# EAGLE design medidor_nao_invasivo (EAGLE 9.5.0)
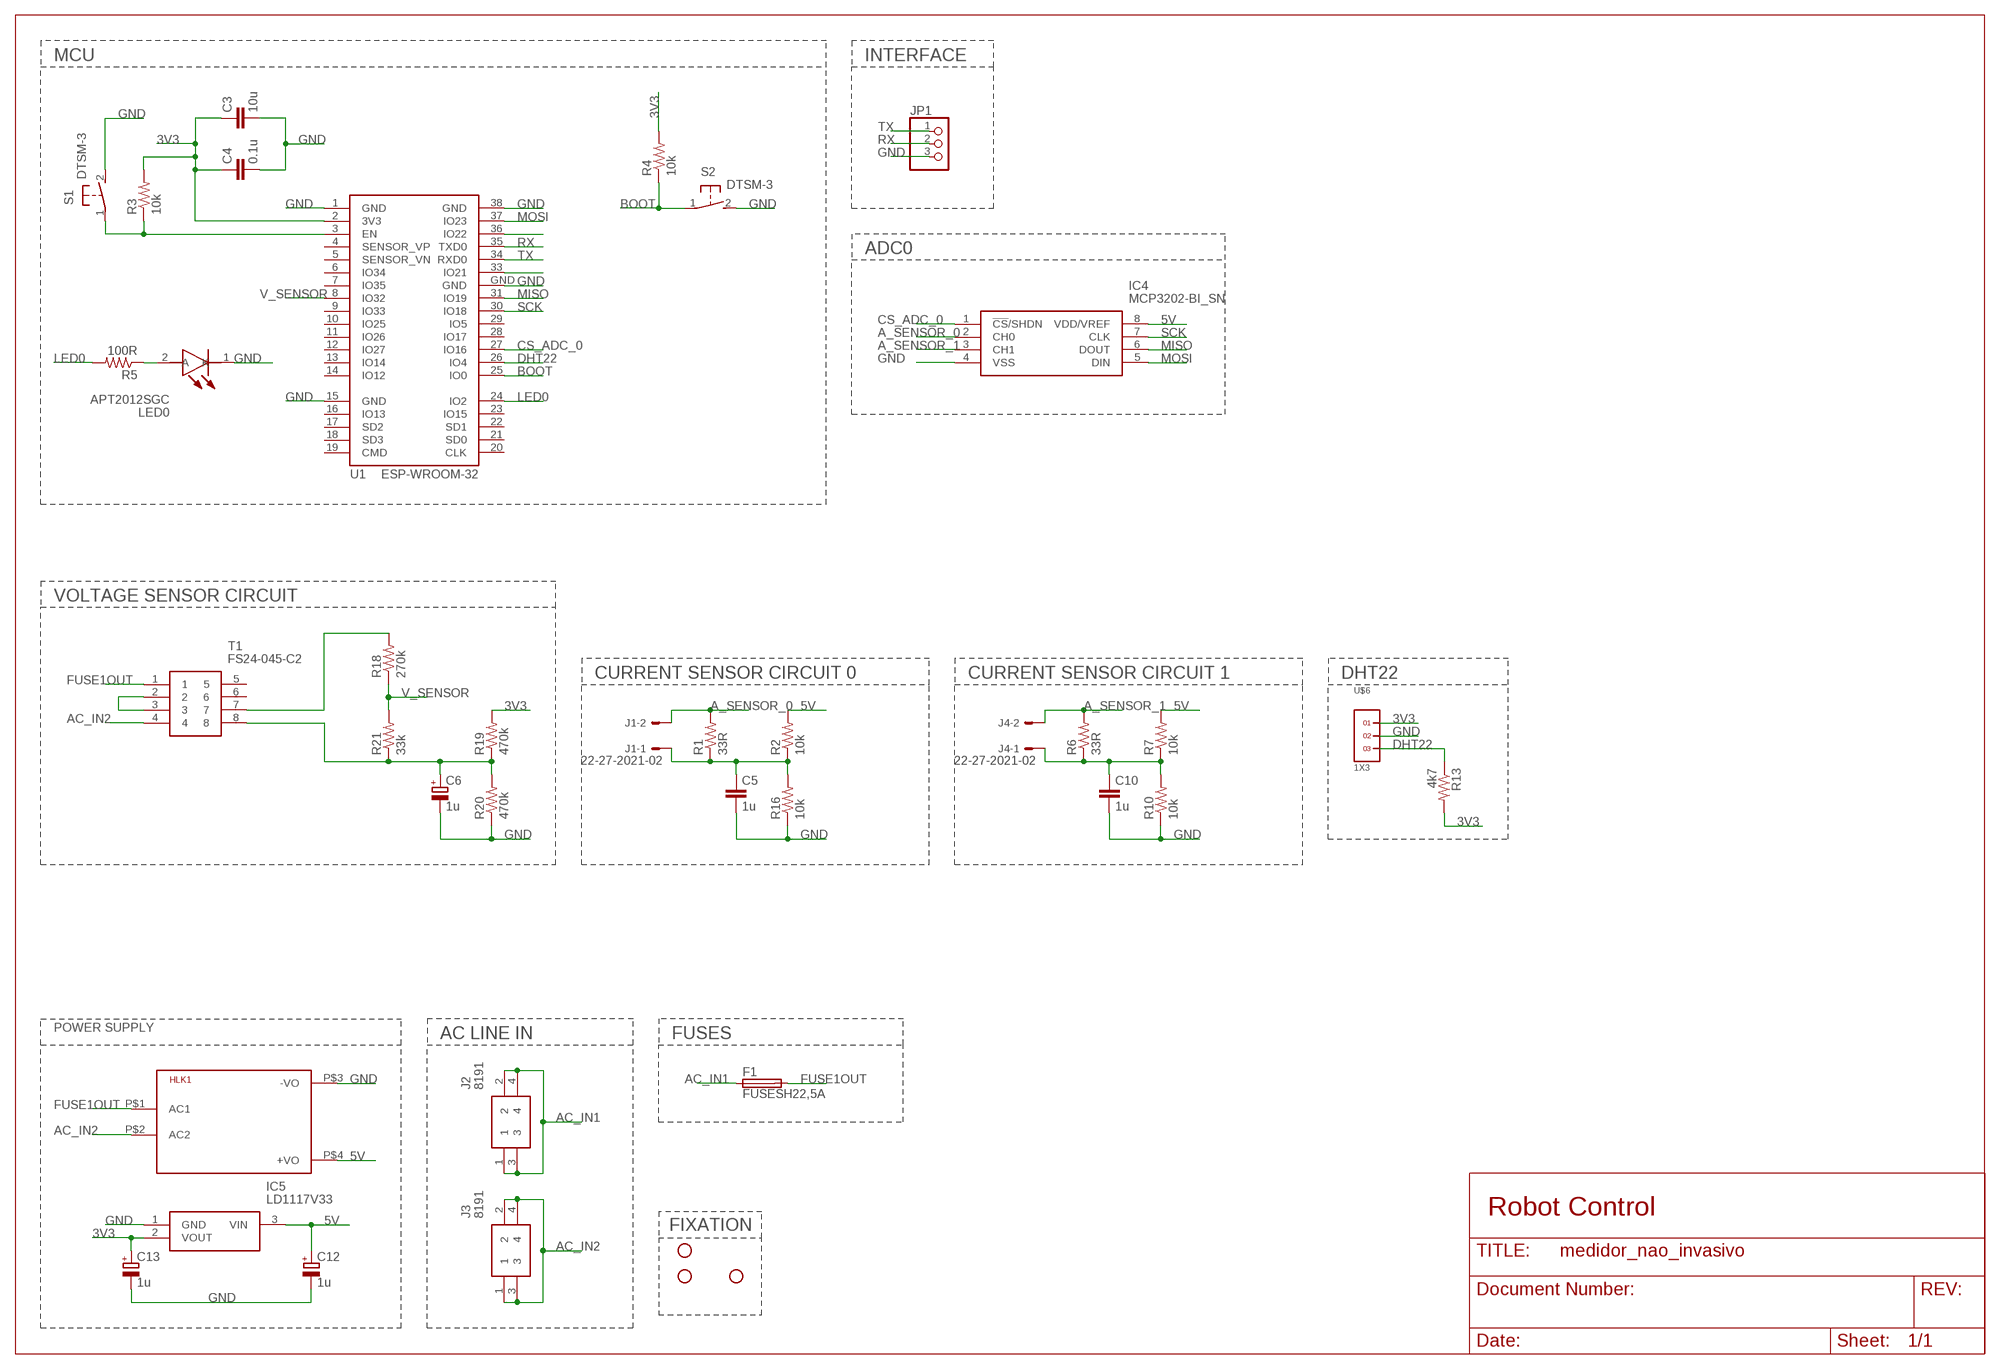
[diagram p0: schematic, sheet 1]

## Parts
C3  10u  C-EUC0805  [C0805]
C4  0.1u  C-EUC0805  [C0805]
C5  1u  C-EUC0805  [C0805]
C6  1u  CPOL-EUE1.8-4  [E1,8-4]
C10  1u  C-EUC0805  [C0805]
C12  1u  CPOL-EUE1.8-4  [E1,8-4]
C13  1u  CPOL-EUE1.8-4  [E1,8-4]
F1  FUSESH22,5A  [SH22,5A]
HLK1  HLK-PM013W  [HLK-PM01]
IC4  MCP3202-BI_SN  [SOIC127P600X175-8N]
IC5  LD1117V33  [TO270P460X1020X2008-3P]
J1  22-27-2021-02  [6410-02]
J2  8191  [8191]
J3  8191  [8191]
J4  22-27-2021-02  [6410-02]
JP1  PINHD-1X3  [1X03]
LED0  APT2012SGC  [LEDC2012X85N]
R1  33R  R-US_R0805  [R0805]
R2  10k  R-US_R0805  [R0805]
R3  10k  R-US_R0805  [R0805]
R4  10k  R-US_R0805  [R0805]
R5  100R  R-US_R0805  [R0805]
R6  33R  R-US_R0805  [R0805]
R7  10k  R-US_R0805  [R0805]
R10  10k  R-US_R0805  [R0805]
R13  4k7  R-US_R0805  [R0805]
R16  10k  R-US_R0805  [R0805]
R18  270k  RESISTORAXIAL-0.3-KIT  [AXIAL-0.3-KIT]
R19  470k  RESISTORAXIAL-0.3-KIT  [AXIAL-0.3-KIT]
R20  470k  RESISTORAXIAL-0.3-KIT  [AXIAL-0.3-KIT]
R21  33k  RESISTORAXIAL-0.3-KIT  [AXIAL-0.3-KIT]
S1  DTSM-3  [DTSM-3]
S2  DTSM-3  [DTSM-3]
STANDOFF1  STAND-OFF  [STAND-OFF]
STANDOFF2  STAND-OFF  [STAND-OFF]
STANDOFF4  STAND-OFF  [STAND-OFF]
T1  FS24-045-C2  [FS24045C2]
U1  ESP-WROOM-32  [ESP-WROOM-32]
U$6  1X3  [1X3]

## Nets
3V3: C3.1 C4.1 C13.+ IC5.2(VOUT) R3.2 R4.2 R13.2 R19.P$2 U1.2(3V3) U$6.1
5V: C12.+ HLK1.P$4(+VO) IC4.8(VDD/VREF) IC5.3(VIN) R2.2 R7.2
A_SENSOR_0: IC4.2(CH0) J1.2 R1.2
A_SENSOR_1: IC4.3(CH1) J4.2 R6.2
AC_IN1: F1.1 J2.1 J2.2 J2.3 J2.4
AC_IN2: HLK1.P$2(AC2) J3.1 J3.2 J3.3 J3.4 T1.4
BOOT: R4.1 S2.1 U1.25(IO0)
CS_ADC_0: IC4.1(!CS!/SHDN) U1.27(IO16)
DHT22: R13.1 U1.26(IO4) U$6.3
FUSE1OUT: F1.2 HLK1.P$1(AC1) T1.1
GND: C3.2 C4.2 C5.2 C6.- C10.2 C12.- C13.- HLK1.P$3(-VO) IC4.4(VSS) IC5.1(GND) JP1.3 LED0.1(K) R10.1 R16.1 R20.P$1 S1.2 S2.2 U1.1(GND) U1.15(GND) U1.38(GND) U1.GND U$6.2
LED0: R5.2 U1.24(IO2)
MISO: IC4.6(DOUT) U1.31(IO19)
MOSI: IC4.5(DIN) U1.37(IO23)
N$1: R18.P$2 T1.7
N$3: T1.2 T1.3
N$4: LED0.2(A) R5.1
N$5: R3.1 S1.1 U1.3(EN)
N$8: U1.33(IO21)
N$9: C10.1 J4.1 R6.1 R7.1 R10.2
N$11: U1.36(IO22)
N$12: C6.+ R19.P$1 R20.P$2 R21.P$1 T1.8
N$16: C5.1 J1.1 R1.1 R2.1 R16.2
RX: JP1.2 U1.35(TXD0)
SCK: IC4.7(CLK) U1.30(IO18)
TX: JP1.1 U1.34(RXD0)
V_SENSOR: R18.P$1 R21.P$2 U1.8(IO32)
Unconnected: T1.5 T1.6 U1.4(SENSOR_VP) U1.5(SENSOR_VN) U1.6(IO34) U1.7(IO35) U1.9(IO33) U1.10(IO25) U1.11(IO26) U1.12(IO27) U1.13(IO14) U1.14(IO12) U1.16(IO13) U1.17(SD2) U1.18(SD3) U1.19(CMD) U1.20(CLK) U1.21(SD0) U1.22(SD1) U1.23(IO15) U1.28(IO17) U1.29(IO5)

## Notes on the sheet
- MCU | INTERFACE
- ADC0
- VOLTAGE SENSOR CIRCUIT
- CURRENT SENSOR CIRCUIT 0 | CURRENT SENSOR CIRCUIT 1 | DHT22
- POWER SUPPLY
- AC LINE IN | FUSES
- Robot Control
- FIXATION

## Library data of the parts
C3-C5 C10 = rcl:C-EU: CAPACITOR, European symbol; SPICEPREFIX: C
C6 C12 C13 = rcl:CPOL-EU: POLARIZED CAPACITOR, European symbol; SPICEPREFIX: C
F1 = fuse:FUSE: Fuse; OC_FARNELL: unknown; OC_NEWARK: unknown
HLK1 = HLK-PM01:HLK-PM01: Hi-Link Power Supply HLK-PM01 3W Author: Ahmed Said <https://github.com/AhmedSaid/EAGLELibraries>
IC4 = SamacSys_Parts:MCP3202-BI_SN: IC, A-D, Converter, 12 bit, SMT, MCP3202BISN Source: Datasheet <https://componentsearchengine.com/Datasheets/1/MCP3202-BI_SN.pdf>; DESCRIPTION: IC, A-D, Converter, 12 bit, SMT, MCP3202BISN; HEIGHT: 1.75mm; MANUFACTURER_NAME: Microchip; MANUFACTURER_PART_NUMBER: MCP3202-BI/SN; MOUSER_PART_NUMBER: 579-MCP3202BISN; MOUSER_PRICE-STOCK: https://www.mouser.com/Search/Refine.aspx?Keyword=579-MCP3202BISN
IC5 = SamacSys_Parts:LD1117V33: 800mA,3.3V,LDO Voltage Reg.,LD1117V33 STMicroelectronics LD1117V33, LDO Voltage Regulator, 1.3A, 3.3 V +/-1%, 3-Pin TO-220 Source: Datasheet <https://componentsearchengine.com/Datasheets/1/LD1117V33.pdf>; DESCRIPTION: 800mA,3.3V,LDO Voltage Reg.,LD1117V33 STMicroelectronics LD1117V33, LDO Voltage Regulator, 1.3A, 3.3 V +/-1%, 3-Pin TO-220; HEIGHT: 4.6mm; MANUFACTURER_NAME: STMicroelectronics; MANUFACTURER_PART_NUMBER: LD1117V33; MOUSER_PART_NUMBER: 511-LD1117V33; MOUSER_PRICE-STOCK: https://www.mouser.com/Search/Refine.aspx?Keyword=511-LD1117V33
J1 J4 = con-molex:22-?-02: CONNECTOR wire to board 2.54 mm (.1 inch) pitch header; MF: MOLEX; OC_FARNELL: unknown; OC_NEWARK: unknown
J2 J3 = SamacSys_Parts:8191: Screw terminal, PC mount, vertical, with screw, metal, 15 Amps Source: Datasheet <https://componentsearchengine.com/Datasheets/1/8191.pdf>; DESCRIPTION: Screw terminal, PC mount, vertical, with screw, metal, 15 Amps; HEIGHT: 6.56mm; MANUFACTURER_NAME: Keystone Electronics; MANUFACTURER_PART_NUMBER: 8191; MOUSER_PART_NUMBER: 534-8191; MOUSER_PRICE-STOCK: https://www.mouser.com/Search/Refine.aspx?Keyword=534-8191
JP1 = pinhead:PINHD-1X3: PIN HEADER
LED0 = SamacSys_Parts:APT2012SGC: 2.5 V Green LED 2012 (0805) SMD, Kingbright APT2012SGC Source: Datasheet <https://componentsearchengine.com/Datasheets/1/APT2012SGC.pdf>; DESCRIPTION: 2.5 V Green LED 2012 (0805) SMD, Kingbright APT2012SGC; HEIGHT: 0.85mm; MANUFACTURER_NAME: Kingbright; MANUFACTURER_PART_NUMBER: APT2012SGC; MOUSER_PART_NUMBER: 604-APT2012SGC; MOUSER_PRICE-STOCK: https://www.mouser.com/Search/Refine.aspx?Keyword=604-APT2012SGC
R1-R7 R10 R13 R16 = rcl:R-US_: RESISTOR, American symbol; SPICEPREFIX: R
R18-R21 = SparkFun-Resistors:RESISTOR: Generic Resistor Package
S1 S2 = switch-tact:DTSM-3
STANDOFF1 STANDOFF2 STANDOFF4 = SparkFun-Hardware:STAND-OFF: Stand Off Drill holes for mechanically mounting via screws, standoffs, etc. Note: Use the keepout ring to avoid running the screw head into surrounding components. Variant Overviews STAND-OFF - Mechanical footprint for a #4 phillips button head screw. STAND-OFF-TIGHT - Mechanical footprint for a #4 phillips button head screw, Example SparkFun Products Screw - Phillips Head (1/4", 4-40, 10 pack) <https://www.sparkfun.com/products/10453> (PRT-10453) Screw - Phillips Head (1/2", 4-40, 10 pack) <https://www.sparkfun.com/products/10452> (PRT-10452) Screw - Phillips Head (3/4", 4-40, 10 pack) <https://www.sparkfun.com/products/10451> (PRT-10451) Screw - Phillips Head (1", 4-40, 10 pack) <https://www.sparkfun.com/products/10450> (PRT-10450)
T1 = SamacSys_Parts:FS24-045-C2: Power Transformers Power Transformer, PC Mount, Class 2/3, 8Pin, 1.1 V A, 12/24VDC (Nominal Secondary) Output, Primary Input, 24VDC CT at 0.045A Secondary in Series, 12VDC at 0.09A Secondary in Parallel Source: Datasheet <https://componentsearchengine.com/Datasheets/1/FS24-045-C2.pdf>; DESCRIPTION: Power Transformers Power Transformer, PC Mount, Class 2/3, 8Pin, 1.1 V A, 12/24VDC (Nominal Secondary) Output, Primary Input, 24VDC CT at 0.045A Secondary in Series, 12VDC at 0.09A Secondary in Parallel; HEIGHT: 28mm; MANUFACTURER_NAME: Triad Magnetics; MANUFACTURER_PART_NUMBER: FS24-045-C2; MOUSER_PART_NUMBER: 553-FS24-045-C2; MOUSER_PRICE-STOCK: https://www.mouser.com/Search/Refine.aspx?Keyword=553-FS24-045-C2
U1 = esp32:ESP-WROOM-32: Espressif Systems ESP-WROOM-32
U$6 = headers(2mm):1X3

## Board
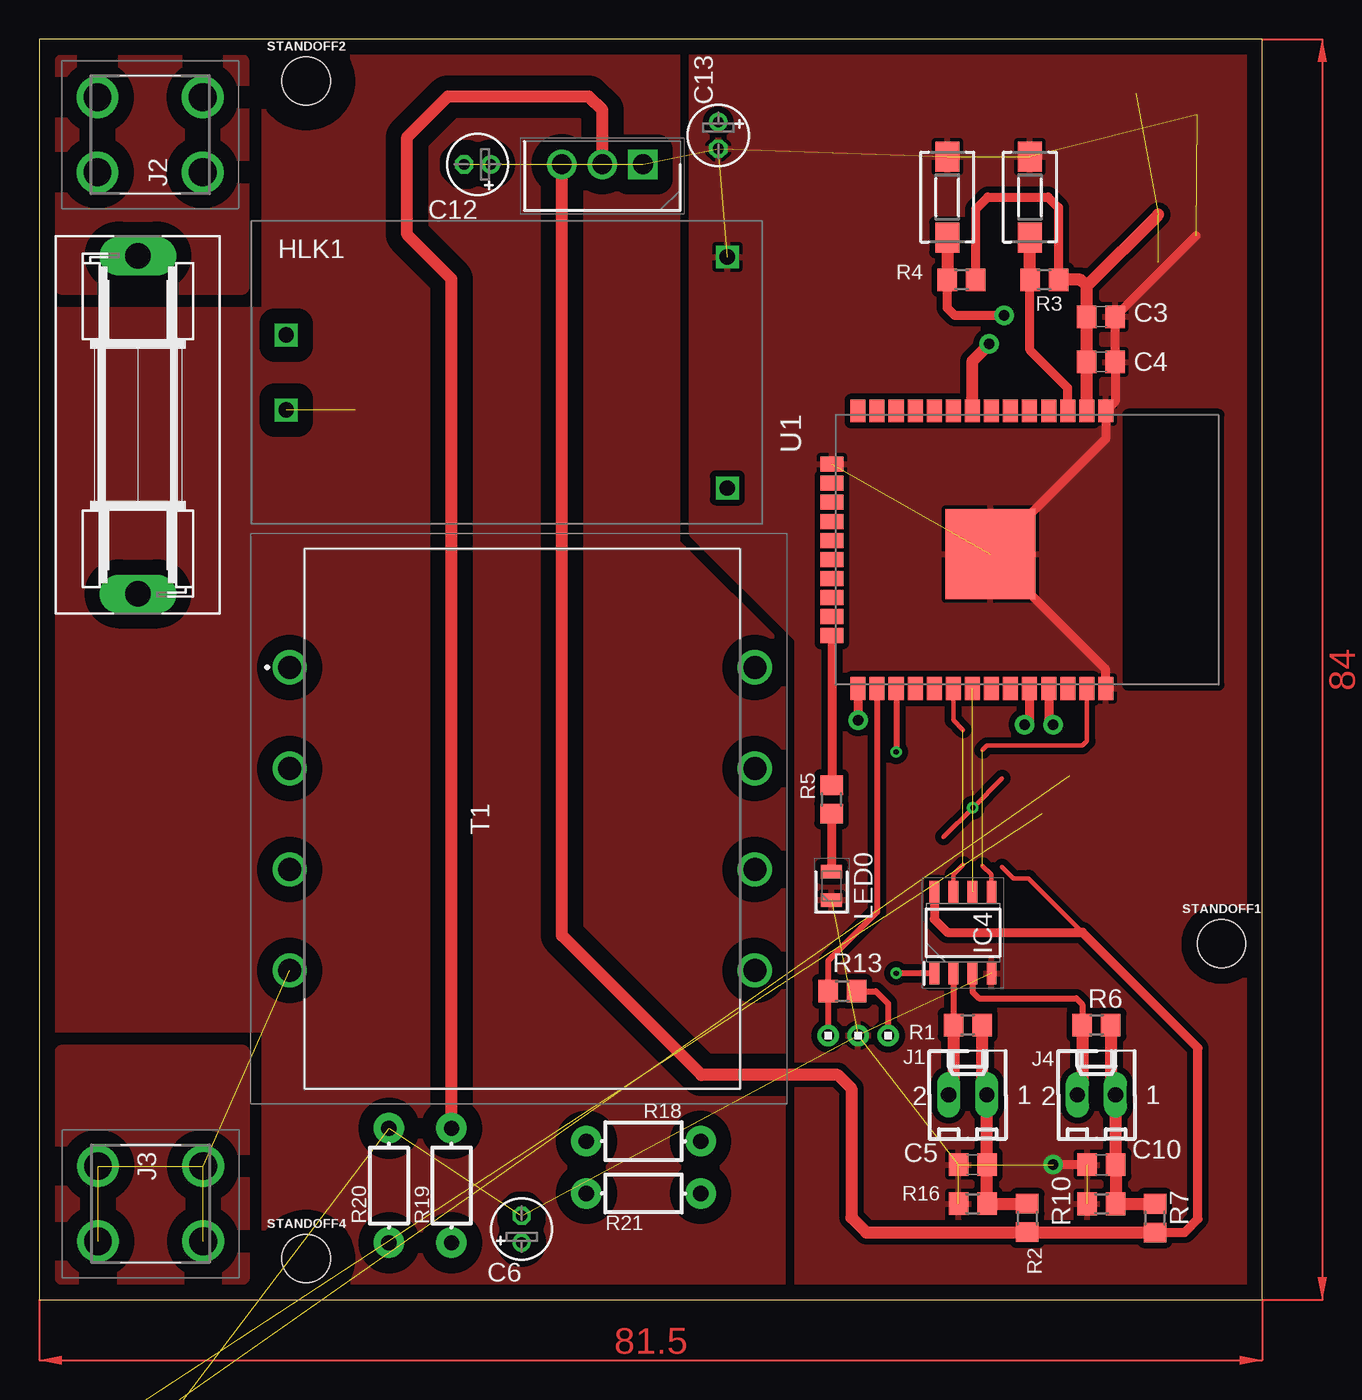
[diagram p1: board, top side]
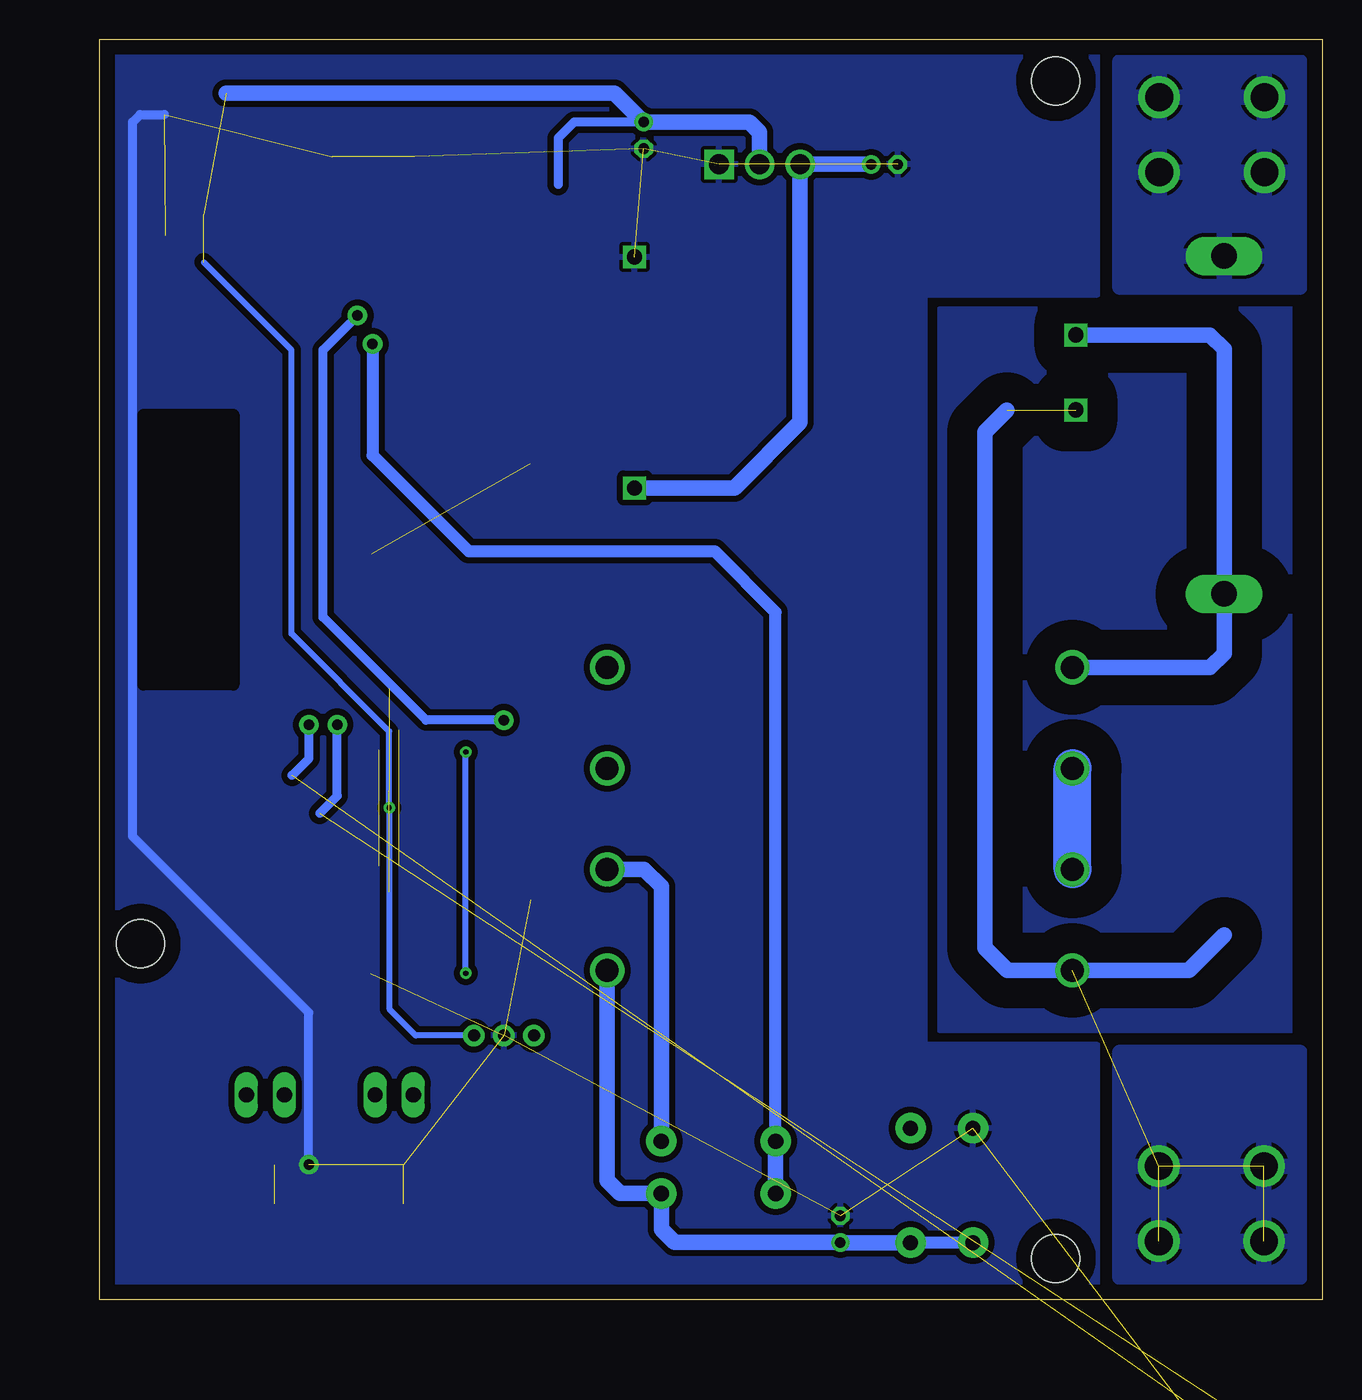
[diagram p2: board, bottom side, seen from below]

Size 81.5 x 84 mm. Coordinates in mm from the lower left corner, seen from the top.
Outline: 0,0 81.5,0 81.5,84 0,84 0,0
Copper layers (1*16): Top 0.035mm / dielectric 1.5mm / Bottom 0.035mm
Design rules "default": minimum track width 6mil, minimum drill 0.35mm, track to track 6mil, track to pad 6mil, pad to pad 6mil, via to via 6mil, smd to smd 6mil, copper to edge 40mil, drill to drill 6mil, minimum pad ring 10mil, minimum via ring 8mil, stop-mask expansion 4mil, vias tented up to drill 0mil, thermal gap 10mil

### Footprints (pad centres in the part's own frame; a part is rotated, then mirrored left to right if it is on the bottom)
C0805 = smd 1.3 x 1.5: 1 -0.95,0; 2 0.95,0
E1,8-4 = drill 0.711 pad 1.168: + -0.889,0 | drill 0.711 pad 1.168 octagon: - 0.889,0
SH22,5A = drill 1.7 pad 2.54 long: 1 -11.252,0; 2 11.252,0
HLK-PM01 = drill 1.016 square: P$1 -14.7,2.5; P$2 -14.7,-2.5; P$3 14.7,7.7; P$4 14.7,-7.7
SOIC127P600X175-8N = smd 1.5 x 0.65: 1 -2.7,1.905; 2 -2.7,0.635; 3 -2.7,-0.635; 4 -2.7,-1.905; 5 2.7,-1.905; 6 2.7,-0.635; 7 2.7,0.635; 8 2.7,1.905
TO270P460X1020X2008-3P = drill 1.32 pad 1.98 square: 1 0,0 | drill 1.32 pad 1.98: 2 2.7,0; 3 5.4,0
6410-02 = drill 1.016 long: 1 1.27,0; 2 -1.27,0
8191 = drill 1.85 pad 2.775: 1 0,0; 2 5,0; 3 5,7.01; 4 0,7.01
1X03 = drill 1.016 long: 1 -2.54,0; 2 0,0; 3 2.54,0
LEDC2012X85N = smd 0.9 x 1.4: 1 -0.95,0; 2 0.95,0
R0805 = smd 1.3 x 1.5: 1 -0.95,0; 2 0.95,0
AXIAL-0.3-KIT = drill 1.016 pad 2.032: P$1 -3.81,0; P$2 3.81,0
DTSM-3 = smd 2 x 1.6: 1 -2.7,0; 2 2.7,0
STAND-OFF = hole 3.2: 0,0
FS24045C2 = drill 1.524 pad 2.286: 1 -10.096,-15.272; 2 -3.365,-15.272; 3 3.365,-15.272; 4 10.096,-15.272; 5 -10.096,15.729; 6 -3.365,15.729; 7 3.365,15.729; 8 10.096,15.729
ESP-WROOM-32 = smd 1.5 x 1: 1 -9.25,7; 2 -9.25,5.73; 3 -9.25,4.46; 4 -9.25,3.19; 5 -9.25,1.92; 6 -9.25,0.65; 7 -9.25,-0.62; 8 -9.25,-1.89; 9 -9.25,-3.16; 10 -9.25,-4.43; 11 -9.25,-5.7; 12 -9.25,-6.97; 13 -9.25,-8.24; 14 -9.25,-9.51; 25 9.25,-9.51; 26 9.25,-8.24; 27 9.25,-6.97; 28 9.25,-5.7; 29 9.25,-4.43; 30 9.25,-3.16; 31 9.25,-1.89; 32 9.25,-0.62; 33 9.25,0.65; 34 9.25,1.92; 35 9.25,3.19; 36 9.25,4.46; 37 9.25,5.73; 38 9.25,7 | smd 1 x 1.5: 15 -5.7,-11.25; 16 -4.43,-11.25; 17 -3.16,-11.25; 18 -1.89,-11.25; 19 -0.62,-11.25; 20 0.65,-11.25; 21 1.92,-11.25; 22 3.19,-11.25; 23 4.46,-11.25; 24 5.73,-11.25 | smd 6 x 6: GND 0.3,-0.7
1X3 = drill 0.8 pad 1.422: 1 -2,0; 2 0,0; 3 2,0

### Placement (x,y rotation side)
C3  70.74,65.52 0 top
C4  70.74,62.51 0 top
C5  62.19,9.02 180 top
C6  32.13,4.72 90 top
C10  70.77,9.01 180 top
C12  29.19,75.68 180 top
C13  45.24,77.61 270 top
F1  6.56,58.31 270 top
HLK1  31.14,61.81 0 top
IC4  61.54,24.47 90 top
IC5  40.21,75.68 180 top
J1  61.86,13.67 0 top
J2  10.88,75.15 90 top
J3  3.9,8.92 270 top
J4  70.44,13.67 0 top
JP1  4.5,-10 0 top  (outside the outline)
LED0  52.78,27.6 90 top
R1  61.86,18.33 180 top
R2  65.83,5.47 270 top
R3  66.95,67.99 0 top
R4  61.45,67.99 0 top
R5  52.79,33.36 90 top
R6  70.44,18.33 180 top
R7  74.33,5.46 270 top
R10  70.77,6.41 0 top
R13  53.5,20.58 0 top
R16  62.19,6.42 0 top
R18  40.25,10.58 0 top
R19  27.46,7.63 90 top
R20  23.29,7.63 270 top
R21  40.25,7.1 180 top
S1  66,73.5 90 top
S2  60.5,73.5 90 top
STANDOFF1  78.76,23.74 0 top
STANDOFF2  17.77,81.22 0 top
STANDOFF4  17.77,2.76 0 top
T1  31.94,32.06 270 top
U1  64.06,50 270 top
U$6  54.55,17.62 180 top

### Tracks (layer width: path | path; a pad name or v marks a point on that pad's centre or on a via)
3V3  (via drill 0.35)  (2 unrouted)
  Top 0.305: 60.25,30.86 v62.2,32.8 64.15,34.76
  Top 0.406: R13.2 55.73,20.58 56.55,19.76 U$6.1
  Top 0.61: R4.2 62.4,72.7 63.2,73.5 67.2,73.5 67.9,72.8 R3.2
  Top 0.813: U1.2 C4.1 C3.1 69.79,67.58 | 69.79,67.58 69.38,67.99 R3.2 | 69.79,67.58 74.55,72.34 | R19.P$2 27.46,68.04 24.5,71 24.5,77.5 27.2,80.2 36.6,80.2 37.51,79.29 IC5.2
  Bottom 0.406: 74.55,69.15 68.7,63.3 68.7,44.4 62.2,37.9 v62.2,32.8 62.2,23 62.2,19.41 62.2,19.4 60.42,17.62 U$6.1
  Bottom 0.61: C13.+ 49.86,78.5 50.93,77.43 50.93,74.33
  Bottom 1.016: IC5.2 37.51,77.81 38.2,78.5 C13.+ 47.17,80.43 73.05,80.43
5V
  Top 0.305: 64.15,28.85 64.9,28.1 65.9,28.1 69.5,24.5
  Top 0.61: R7.2 76.31,4.51 77.2,5.4 77.2,16.8 69.5,24.5 60.5,24.5 59.63,25.36 IC4.8
  Top 0.813: R7.2 R2.2 65.81,4.5 55.1,4.5 54.1,5.5 54.1,14.1 53.2,15 44.1,15 34.81,24.29 IC5.3
  Bottom 1.016: C12.+ IC5.3 34.81,58.49 39.2,54.1 HLK1.P$4
A_SENSOR_0
  Top 0.406: IC4.2 R1.2
  Top 0.61: IC4.2
  Top 0.813: R1.2 60.91,13.99 J1.2
A_SENSOR_1
  Top 0.406: IC4.3 62.17,20.52 62.6,20.1 69.09,20.1 69.49,19.7 R6.2
  Top 0.813: R6.2 69.49,13.99 J4.2
AC
  pour Bottom (isolate 2): 1,66 25.5,66 25.5,18 1,18
AC_IN1
  pour Bottom: 1.51,82.5 13.49,82.5 13.49,67.48 1.51,67.48
AC_IN2  (5 unrouted)
  Bottom 1.016: 6.54,24.32 8.9,21.96 T1.4 21,21.96 22.5,23.46 22.5,57.84 21.03,59.31
  pour Bottom: 1.51,1.5 13.51,1.5 13.51,16.51 1.51,16.51
AC_TOP
  pour Top (isolate 1.016): 1,66 15,66 15,84 42.5,84 42.5,50.5 49.5,43.5 49.5,0 15,0 15,18 1,18
BOOT  (via drill 0.7 pad 1.3)
  Top 0.61: U1.25 v54.55,38.65 | v64.3,65.6 61,65.6 60.5,66.1 R4.1
  Top 0.813: S2.1 R4.1
  Bottom 0.61: v54.55,38.65 59.75,38.65 66.6,45.5 66.6,63.3 v64.3,65.6
CS_ADC_0  (via drill 0.35)
  Top 0.406: U1.27 v57.09,36.52 | IC4.1 v57.09,21.77
  Bottom 0.406: v57.09,21.77 v57.09,36.52
DHT22
  Top 0.406: U1.26 55.82,25.86 52.55,22.59 R13.1 U$6.3
FUSE1OUT
  Bottom 1.016: T1.1 7.49,42.16 6.56,43.09 F1.2 6.56,63.37 7.5,64.31 HLK1.P$1
GND  (via drill 0.7 pad 1.3)  (17 unrouted)
  Top 0.61: C10.2 v67.55,9.01 | 77.09,70.92 C3.2 C4.2 71.69,59.88 U1.1 71.06,57.4 U1.GND 71.06,42 U1.38
  Bottom 0.61: v67.55,9.01 67.55,19.15 79.3,30.9 79.3,78.5 78.8,79 77.16,79
  pour Bottom (isolate 0.406): 15,0 15,17 26.5,17 26.5,67 15,67 15,84 81.5,84 81.5,0
  pour Top (isolate 0.406): 50.5,0 50.5,44 43.5,51 43.5,84 81.5,84 81.5,0
LED0
  Top 0.61: U1.24 52.81,34.33 R5.2
MISO  (1 unrouted)
  Top 0.305: 62.2,27.2 IC4.6
MOSI  (1 unrouted)
  Top 0.305: IC4.5 63.45,28.34 62.85,28.94 | 62.85,36.65 63.14,36.94 69.5,36.94 69.8,37.24 U1.37
N$1
  Bottom 1.016: R18.P$2 44.06,27.56 45.2,28.7 T1.7
N$3
  Bottom 2.54: T1.3 T1.2
N$4
  Top 0.61: R5.1 LED0.2
N$5
  Top 0.61: U1.3 68.52,60.78 66,63.3 R3.1
  Top 0.813: R3.1 S1.1
N$7
  pour Top (isolate 1.016): 1.51,16.51 13.51,16.51 13.51,1.5 1.51,1.5
N$9
  Top 0.813: R6.1 71.39,13.99 J4.1 C10.1 R10.2 R7.1
N$10
  pour Top (isolate 1.016): 1.51,67.48 1.51,82.5 13.49,82.5 13.49,67.48
N$12
  Bottom 0.813: R20.P$2 R19.P$1
  Bottom 1.016: T1.8 47.67,7.97 46.8,7.1 R21.P$1 44.06,4.72 43.17,3.83 C6.+ 32.12,3.82 R19.P$1
N$16
  Top 0.813: R1.1 62.81,13.99 J1.1 C5.1 R16.2 R2.1
RX  (via drill 0.7 pad 1.3)  (1 unrouted)
  Top 0.61: U1.35 67.25,38.63 v67.54,38.34
  Bottom 0.61: 68.67,34.97 67.54,36.1 v67.54,38.34
SCK  (1 unrouted)
  Top 0.305: 61.55,29 60.9,28.35 IC4.7 | 61.55,38 60.9,38.65 U1.30
  Top 0.61: U1.30
TX  (via drill 0.7 pad 1.3)  (1 unrouted)
  Top 0.61: U1.34 65.98,38.67 v65.66,38.35
  Bottom 0.61: 66.83,32.43 65.66,33.6 v65.66,38.35
V_SENSOR  (via drill 0.7 pad 1.3)
  Top 0.813: U1.8 62.17,62.57 v63.3,63.7
  Bottom 0.813: R18.P$1 36.44,45.84 40.5,49.9 56.9,49.9 63.3,56.3 v63.3,63.7
  Bottom 1.016: R21.P$2 R18.P$1
(copper drawn outside any net)
  shapes: Top area x2